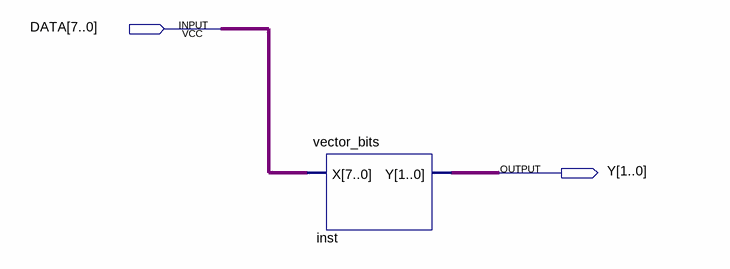
[diagram p0: schematic sheet]
// Quartus schematic myproject.bdf as structural Verilog: 1 symbols, 2 pins
module myproject (
  input  [7:0] DATA,
  output [1:0] Y
);

  vector_bits inst (.X(DATA), .Y(Y));
endmodule
